# EAGLE design RadioPixelHardware (EAGLE 7.1.0)
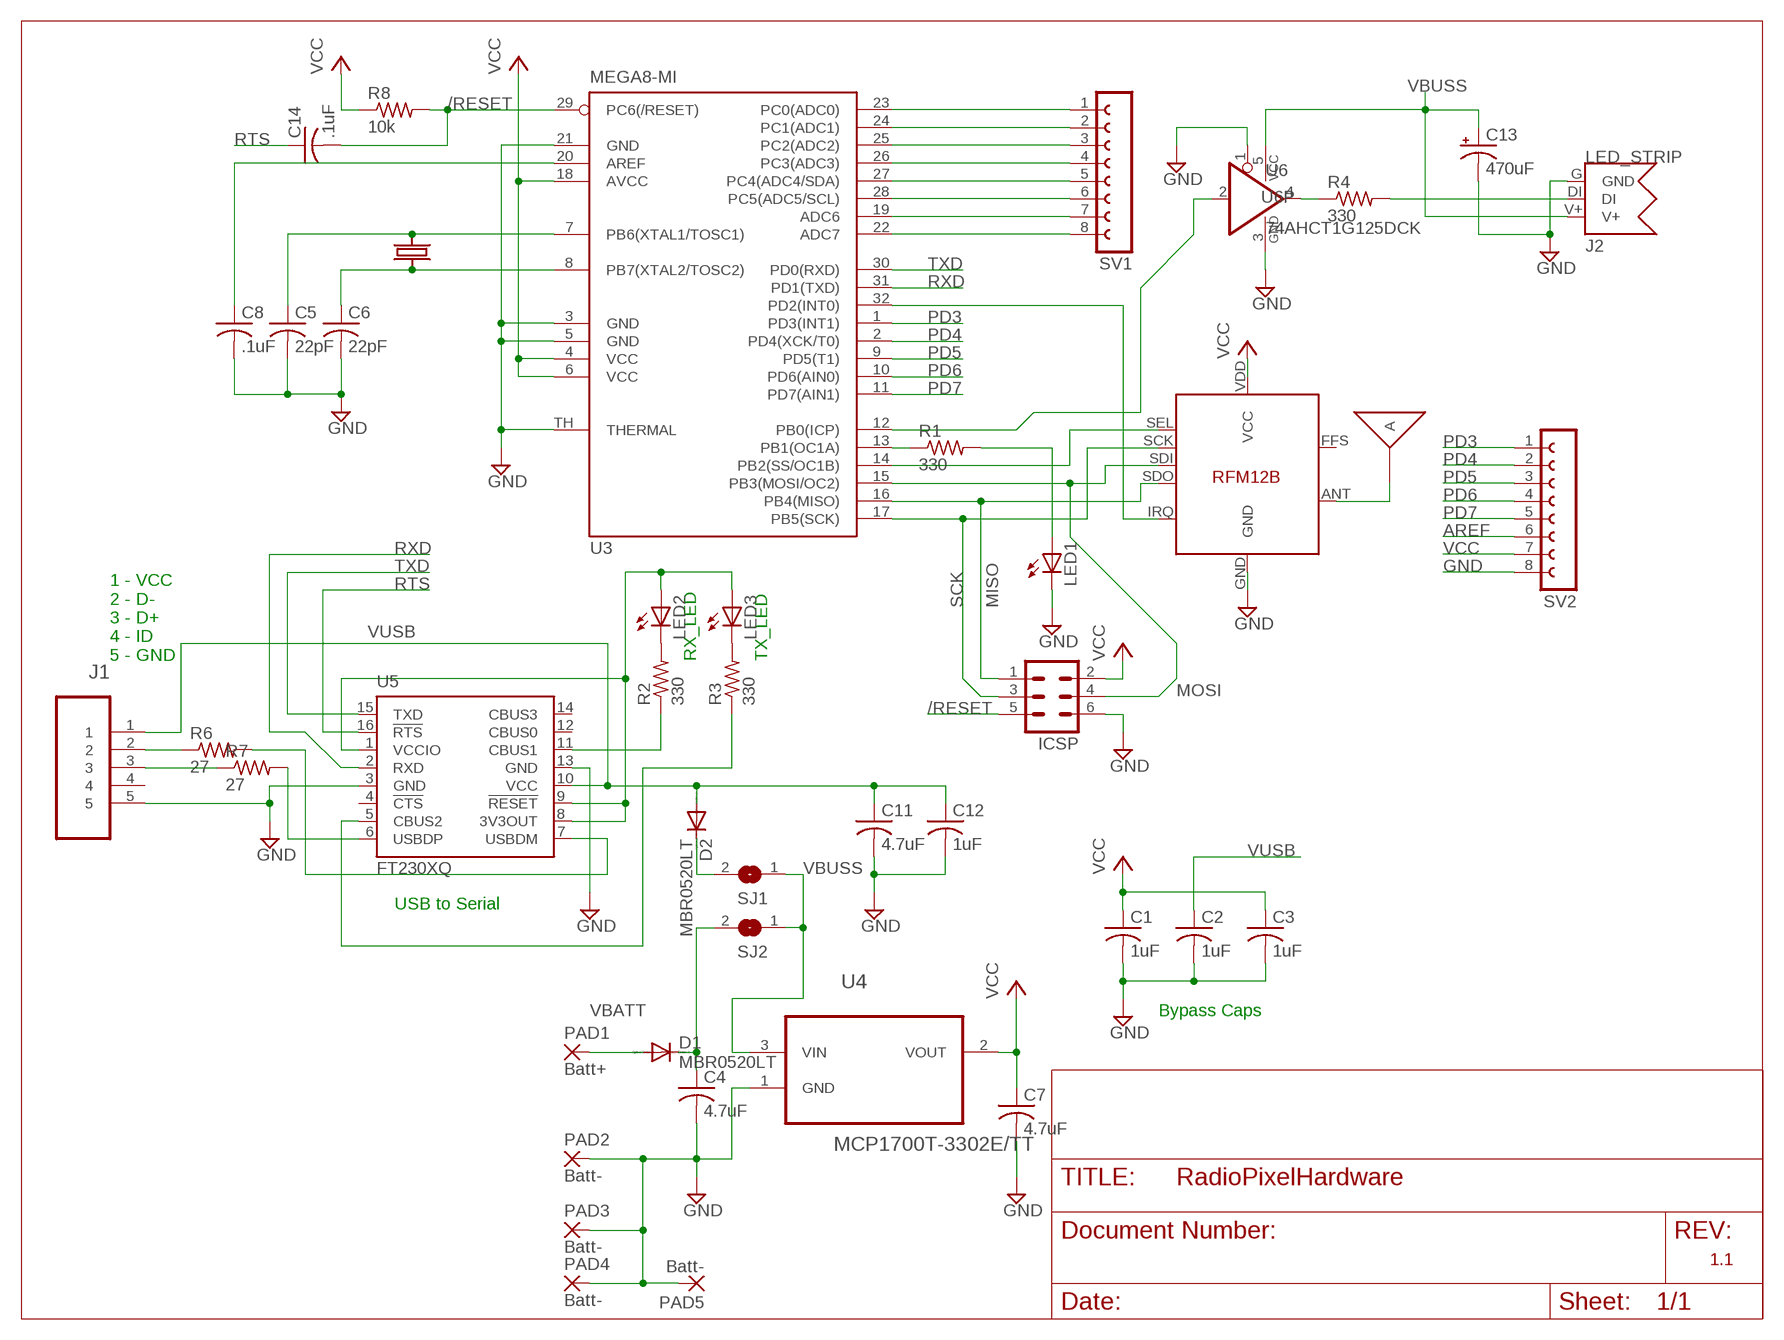
[diagram p0: schematic, sheet 1]

## Parts
C1  1uF  C-USC0603  [C0603]
C2  1uF  C-USC0603  [C0603]
C3  1uF  C-USC0603  [C0603]
C4  4.7uF  C-USC0603  [C0603]
C5  22pF  C-USC0603  [C0603]
C6  22pF  C-USC0603  [C0603]
C7  4.7uF  C-USC0603  [C0603]
C8  .1uF  C-USC0603  [C0603]
C11  4.7uF  C-USC0603  [C0603]
C12  1uF  C-USC0603  [C0603]
C13  470uF  CPOL-USTT2D4L  [TT2D4L]
C14  .1uF  C-USC0603  [C0603]
D1  MBR0520LT  [SOD123]
D2  MBR0520LT  [SOD123]
ICSP  MA03-2  [MA03-2]
J1  47346-0001  [MOLEX_47346-0001]
J2  LED_STRIP  [LEDSTRIP_HEAD]
LED1  LEDSML0603  [SML0603]
LED2  LEDSML0603  [SML0603]
LED3  LEDSML0603  [SML0603]
PAD1  Batt+  1,6/0,8  [1,6/0,8]
PAD2  Batt-  1,6/0,8  [1,6/0,8]
PAD3  Batt-  1,6/0,8  [1,6/0,8]
PAD4  Batt-  1,6/0,8  [1,6/0,8]
PAD5  Batt-  1,6/0,8  [1,6/0,8]
R1  330  R-US_R0603  [R0603]
R2  330  R-US_R0603  [R0603]
R3  330  R-US_R0603  [R0603]
R4  330  R-US_R0603  [R0603]
R6  27  R-US_R0603  [R0603]
R7  27  R-US_R0603  [R0603]
R8  10k  R-US_R0603  [R0603]
SJ1  SJ  [SJ]
SJ2  SJ  [SJ]
SV1  FE08-1  [FE08]
SV2  FE08-1  [FE08]
U2  RFM12B  [RFM12B]
U3  MEGA8-MI  [MLF32-TH]
U4  MCP1700T-3302E/TT  [SOT95P237X112-3N]
U5  FT230XQ  [QFN16]
U6  74AHCT1G125DCK  [SC70-5]
U$2  ANTANT-PCB-868MHZ  [ANT-900MHZ-60DBM]
X1  CRYSTAL3.2MMX2.5MM  [XTAL-SMD-3.2X2.5]

## Nets
/RESET: C14.2 ICSP.5 R8.2 U3.29(PC6(/RESET))
AREF: C8.1 SV2.6 U3.20(AREF)
GND: C1.2 C2.2 C3.2 C4.2 C5.2 C6.2 C7.2 C8.2 C11.2 C12.2 C13.- ICSP.6 J1.5 J2.G(GND) LED1.C PAD2.1(P) PAD3.1(P) PAD4.1(P) PAD5.1(P) SV2.8 U2.GND U3.3(GND) U3.5(GND) U3.21(GND) U3.TH(THERMAL) U4.1(GND) U5.3(GND) U5.13(GND) U6.1(OE) U6.3(GND)
MISO: ICSP.1 U2.SDO U3.16(PB4(MISO))
MOSI: ICSP.4 U2.SDI U3.15(PB3(MOSI/OC2))
N$4: U2.SEL U3.14(PB2(SS/OC1B))
N$5: U2.IRQ U3.32(PD2(INT0))
N$6: U2.ANT U$2.P$1(A)
N$7: R1.1 U3.13(PB1(OC1A))
N$8: LED1.A R1.2
N$9: R4.1 U6.4(O)
N$11: R2.1 U5.11(CBUS1)
N$12: U3.12(PB0(ICP)) U6.2(I)
N$13: R7.2 U5.6(USBDP)
N$14: R6.2 U5.7(USBDM)
N$15: C4.1 D1.C SJ2.2
N$16: LED2.C R2.2
N$17: LED3.C R3.2
N$18: J1.2 R6.1
N$19: R3.1 U5.5(CBUS2)
N$20: C5.1 U3.7(PB6(XTAL1/TOSC1)) X1.3
N$21: D2.C SJ1.2
N$22: C6.1 U3.8(PB7(XTAL2/TOSC2)) X1.1
N$23: J1.3 R7.1
N$24: SV1.1 U3.23(PC0(ADC0))
N$25: SV1.2 U3.24(PC1(ADC1))
N$26: SV1.3 U3.25(PC2(ADC2))
N$27: SV1.4 U3.26(PC3(ADC3))
N$28: SV1.5 U3.27(PC4(ADC4/SDA))
N$29: SV1.6 U3.28(PC5(ADC5/SCL))
N$30: SV1.7 U3.19(ADC6)
N$31: SV1.8 U3.22(ADC7)
N$32: J2.DI R4.2
PD3: SV2.1 U3.1(PD3(INT1))
PD4: SV2.2 U3.2(PD4(XCK/T0))
PD5: SV2.3 U3.9(PD5(T1))
PD6: SV2.4 U3.10(PD6(AIN0))
PD7: SV2.5 U3.11(PD7(AIN1))
RTS: C14.1 U5.16(!RTS)
RXD: U3.31(PD1(TXD)) U5.2(RXD)
SCK: ICSP.3 U2.SCK U3.17(PB5(SCK))
TXD: U3.30(PD0(RXD)) U5.15(TXD)
USB3V3: LED2.A LED3.A U5.1(VCCIO) U5.8(3V3OUT) U5.9(!RESET)
VBATT: D1.A PAD1.1(P)
VBUSS: C13.+ J2.V+ SJ1.1 SJ2.1 U4.3(VIN) U6.5(VCC)
VCC: C1.1 C3.1 C7.1 ICSP.2 R8.1 SV2.7 U2.VDD(VCC) U3.4(VCC) U3.6(VCC) U3.18(AVCC) U4.2(VOUT)
VUSB: C2.1 C11.1 C12.1 D2.A J1.1 U5.10(VCC)
Unconnected: J1.4 U2.FFS U5.4(!CTS) U5.12(CBUS0) U5.14(CBUS3)

## Notes on the sheet
- 1 - VCC
  2 - D-
  3 - D+
  4 - ID
  5 - GND
- RX_LED | TX_LED
- USB to Serial
- Bypass Caps
- 1.1

## Library data of the parts
C1-C8 C11 C12 C14 = resistor:C-US: CAPACITOR, American symbol
C13 = rcl:CPOL-US: POLARIZED CAPACITOR, American symbol; OC_NEWARK: 39T9032
D1 D2 = diode:MBR0520LT: SCHOTTKY BARRIER RECTIFIER Source: http://onsemi.com .. MBR0520LT1-D.pdf
ICSP = con-lstb:MA03-2: PIN HEADER; OC_FARNELL: unknown; OC_NEWARK: unknown
J1 = Molex-47346-0001:47346-0001: CONN RCPT 5POS MICRO USB R/A SMD; MPN: 47346-0001; OC_FARNELL: 1568026; OC_NEWARK: 47M0505; PACKAGE: 5 POS MICRO USB R/A; SUPPLIER: MOLEX
J2 = Dan Afonso:LED_STRIP
LED1-LED3 = led:LED: LED OSRAM: - CHIPLED LG R971, LG N971, LY N971, LG Q971, LY Q971, LO R971, LY R971 LH N974, LH R974 LS Q976, LO Q976, LY Q976 LO Q996 - Hyper CHIPLED LW Q18S LB Q993, LB Q99A, LB R99A - SideLED LS A670, LO A670, LY A670, LG A670, LP A670 LB A673, LV A673, LT A673, LW A673 LH A674 LY A675 LS A676, LA A676, LO A676, LY A676, LW A676 LS A679, LY A679, LG A679 - Hyper Micro SIDELED® LS Y876, LA Y876, LO Y876, LY Y876 LT Y87S - SmartLED LW L88C, LW L88S LB L89C, LB L89S, LG L890 LS L89K, LO L89K, LY L89K LS L896, LA L896, LO L896, LY L896 - TOPLED LS T670, LO T670, LY T670, LG T670, LP T670 LSG T670, LSP T670, LSY T670, LOP T670, LYG T670 LG T671, LOG T671, LSG T671 LB T673, LV T673, LT T673, LW T673 LH T674 LS T676, LA T676, LO T676, LY T676, LB T676, LH T676, LSB T676, LW T676 LB T67C, LV T67C, LT T67C, LS T67K, LO T67K, LY T67K, LW E67C LS E67B, LA E67B, LO E67B, LY E67B, LB E67C, LV E67C, LT E67C LW T67C LS T679, LY T679, LG T679 LS T770, LO T770, LY T770, LG T770, LP T770 LB T773, LV T773, LT T773, LW T773 LH T774 LS E675, LA E675, LY E675, LS T675 LS T776, LA T776, LO T776, LY T776, LB T776 LHGB T686 LT T68C, LB T68C - Hyper Mini TOPLED® LB M676 - Mini TOPLED Santana® LG M470 LS M47K, LO M47K, LY M47K Source: http://www.osram.convergy.de LUXEON: - LUMILED® LXK2-PW12-R00, LXK2-PW12-S00, LXK2-PW14-U00, LXK2-PW14-V00 LXK2-PM12-R00, LXK2-PM12-S00, LXK2-PM14-U00 LXK2-PE12-Q00, LXK2-PE12-R00, LXK2-PE12-S00, LXK2-PE14-T00, LXK2-PE14-U00 LXK2-PB12-K00, LXK2-PB12-L00, LXK2-PB12-M00, LXK2-PB14-N00, LXK2-PB14-P00, LXK2-PB14-Q00 LXK2-PR12-L00, LXK2-PR12-M00, LXK2-PR14-Q00, LXK2-PR14-R00 LXK2-PD12-Q00, LXK2-PD12-R00, LXK2-PD12-S00 LXK2-PH12-R00, LXK2-PH12-S00 LXK2-PL12-P00, LXK2-PL12-Q00, LXK2-PL12-R00 Source: www.luxeon.com KINGBRIGHT: KA-3528ASYC Source: www.kingbright.com
PAD1-PAD5 = wirepad:1,6/0,8: THROUGH-HOLE PAD
R1-R4 R6-R8 = resistor:R-US_: RESISTOR, American symbol
SJ1 SJ2 = jumper:SJ: SMD solder JUMPER
SV1 SV2 = con-lsta:FE08-1: FEMALE HEADER; OC_FARNELL: unknown; OC_NEWARK: unknown
U2 = JeeParts:RFM12B
U3 = atmel:MEGA8-MI: MICROCONTROLLER 8 Kbytes FLASH, 1 kbytes SRAM, 512 bytes EEPROM, USART, 6-channel 10 bit ADC, 2-channel 8 bit ADC Pin compatible with Atmega48, ATMega88, ATMega168 Source: avr.lbr; MPN: ATMEGA88PA-MU; OC_FARNELL: 1715491; OC_NEWARK: 15R0272
U4 = Dan Afonso:MCP1700T-3302E/TT: Low Quiescent Current LDO; MPN: MCP1700T-3302E/TT; OC_FARNELL: 1296592; OC_NEWARK: 88H9817; PACKAGE: SOT23-3; SUPPLIER: Microchip
U5 = ftdichip:FT230X: USB to BASIC UART IC Auto generated by make-symbol-device-package-bsdl.ulp Rev. 43 Source: Data sheet <http://www.ftdichip.com/Support/Documents/DataSheets/ICs/DS_FT230X.pdf>
U6 = 74xx-little-de:74*1G125: Single Bus Buffer Gate with 3-State Output; OC_NEWARK: 76C1732
U$2 = Dan Afonso:ANT: PCB Antenna - 868-920MHz This large PCB antenna is modeled after Texas Instruments DN024 <http://www.ti.com/general/docs/lit/getliterature.tsp?baseLiteratureNumber=swra227> application note. Key features Single Band Mode (868 MHz, 915 MHz or 920 MHz) Dual Band Mode (868 MHz & 2440 MHz) PCB Antenna Monopole Antenna Excellent Efficiency Recommended Antenna Design for 868 MHz, 915 MHz & 920 MHz
X1 = Dan Afonso:CRYSTAL: TXC Crystal 3.2mm x 2.5mm; OC_NEWARK: 24T5694

## Board
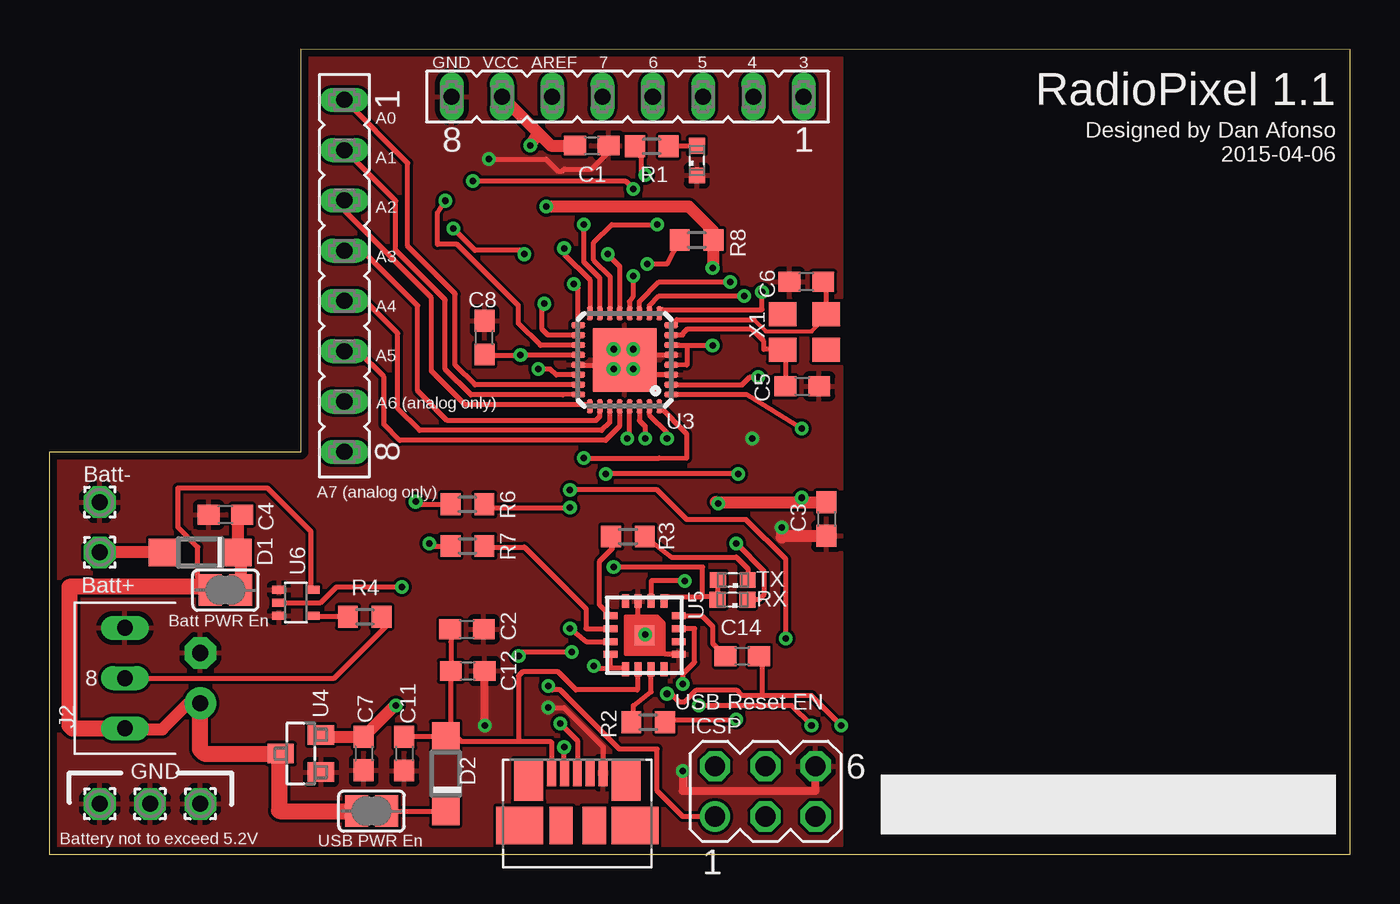
[diagram p1: board, top side]
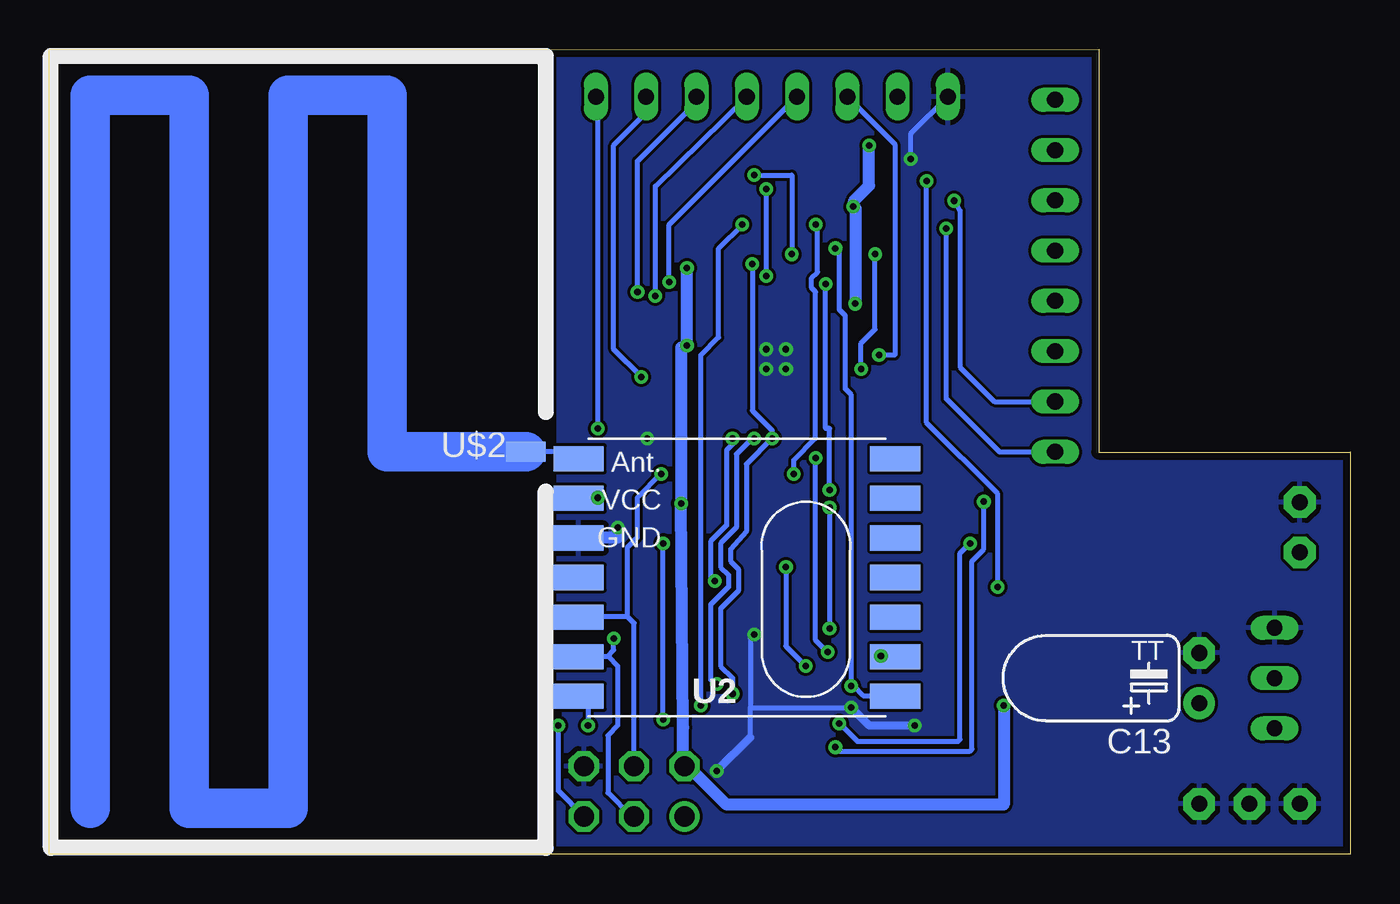
[diagram p2: board, bottom side, seen from below]

Size 65.71 x 40.64 mm. Coordinates in mm from the lower left corner, seen from the top.
Outline: 0,20.31 12.7,20.31 12.7,40.64 65.71,40.63 65.71,0 0,0 0,20.31
Outline: 0,20.32 0,20.31
Copper layers (1*16): Top 0.0356mm / dielectric 1.5011mm / Bottom 0.0356mm
Design rules "OSHPark": minimum track width 6mil, minimum drill 13mil, track to track 6mil, track to pad 6mil, pad to pad 6mil, via to via 6mil, smd to smd 6mil, copper to edge 15mil, drill to drill 6mil, minimum pad ring 7mil, minimum via ring 7mil, stop-mask expansion 3mil, vias tented up to drill 0mil, thermal gap 10mil

### Footprints (pad centres in the part's own frame; a part is rotated, then mirrored left to right if it is on the bottom)
C0603 = smd 1.1 x 1: 1 -0.85,0; 2 0.85,0
TT2D4L = drill 0.813 pad 1.6: + -1.27,0 | drill 0.813 pad 1.6 octagon: - 1.27,0
SOD123 = smd 1.4 x 1.4: A 1.9,0; C -1.9,0
MA03-2 = drill 1.016: 1 -2.54,-1.27 | drill 1.016 octagon: 2 -2.54,1.27; 3 0,-1.27; 4 0,1.27; 5 2.54,-1.27; 6 2.54,1.27
MOLEX_47346-0001 = smd 0.45 x 1.38: 1 -1.3,0; 2 -0.65,0; 3 0,0; 4 0.65,0; 5 1.3,0 | smd 1.475 x 2.1: M1 -2.462,-0.36; M2 2.462,-0.36 | smd 2.375 x 1.9: M3 -2.913,-2.66; M6 2.913,-2.66 | smd 1.175 x 1.9: M4 -0.82,-2.66; M5 0.85,-2.66
LEDSTRIP_HEAD = drill 0.8 long: DI 0,0; G 0,2.54; V+ 0,-2.54
SML0603 = smd 0.8 x 0.8: A 0.75,0; C -0.75,0
1,6/0,8 = drill 0.813 pad 1.6 octagon: 1 0,0
R0603 = smd 1 x 1.1: 1 -0.85,0; 2 0.85,0
SJ = smd 1.168 x 1.6: 1 -0.762,0; 2 0.762,0
FE08 = drill 0.813 long: 1 -8.89,0; 2 -6.35,0; 3 -3.81,0; 4 -1.27,0; 5 1.27,0; 6 3.81,0; 7 6.35,0; 8 8.89,0
RFM12B = smd 2.54 x 1.27: ANT 8,-6; FFS -8,2; GND 8,-2; IRQ -8,4; P$8 -8,0; P$9 -8,-2; P$10 -8,-4; P$12 -8,-6; P$16 8,0; SCK 8,4; SDI 8,2; SDO -8,6; SEL 8,6; VDD 8,-4
MLF32-TH = smd 0.7 x 0.3: 1 -2.35,1.75; 2 -2.35,1.25; 3 -2.35,0.75; 4 -2.35,0.25; 5 -2.35,-0.25; 6 -2.35,-0.75; 7 -2.35,-1.25; 8 -2.35,-1.75; 17 2.35,-1.75; 18 2.35,-1.25; 19 2.35,-0.75; 20 2.35,-0.25; 21 2.35,0.25; 22 2.35,0.75; 23 2.35,1.25; 24 2.35,1.75 | smd 0.3 x 0.7: 9 -1.75,-2.35; 10 -1.25,-2.35; 11 -0.75,-2.35; 12 -0.25,-2.35; 13 0.25,-2.35; 14 0.75,-2.35; 15 1.25,-2.35; 16 1.75,-2.35; 25 1.75,2.35; 26 1.25,2.35; 27 0.75,2.35; 28 0.25,2.35; 29 -0.25,2.35; 30 -0.75,2.35; 31 -1.25,2.35; 32 -1.75,2.35 | smd 3.2 x 3.2: TH 0,0
SOT95P237X112-3N = smd 0.991 x 1.321: 1 -0.94,-1.016; 2 0.94,-1.016; 3 0,1.016
QFN16 = smd 0.7 x 0.35: 1 -1.725,0.975; 2 -1.725,0.325; 3 -1.725,-0.325; 4 -1.725,-0.975; 9 1.725,-0.975; 10 1.725,-0.325; 11 1.725,0.325; 12 1.725,0.975 | smd 0.35 x 0.7: 5 -0.975,-1.725; 6 -0.325,-1.725; 7 0.325,-1.725; 8 0.975,-1.725; 13 0.975,1.725; 14 0.325,1.725; 15 -0.325,1.725; 16 -0.975,1.725 | smd 1 x 1: TAB 0,0
SC70-5 = smd 0.4 x 0.7: 1 -0.65,-0.85; 2 0,-0.85; 3 0.65,-0.85; 4 0.65,0.85; 5 -0.65,0.85
ANT-900MHZ-60DBM = smd 1 x 2: P$1 0,1
XTAL-SMD-3.2X2.5 = smd 1.4 x 1.2: 1 -1.1,-0.9; 2 1.1,-0.9; 3 1.1,0.9; 4 -1.1,0.9

### Placement (x,y rotation side)
C1  27.4,35.79 0 top
C2  21.09,11.36 0 top
C3  39.25,16.93 270 top
C4  8.89,17.14 180 top
C5  38.04,23.63 0 top
C6  38.24,28.91 180 top
C7  15.88,5.08 270 top
C8  21.98,26.09 90 top
C11  17.93,5.07 270 top
C12  21.13,9.25 0 top
C13  7.62,8.89 90 bottom
C14  35,10 0 top
D1  7.62,15.24 180 top
D2  20.02,4.07 90 top
ICSP  36.17,3.17 0 top
J1  26.67,4.11 0 top
J2  3.81,8.89 0 top
LED1  32.71,35.03 90 top
LED2  34.51,12.86 180 top
LED3  34.53,13.85 180 top
PAD1  2.54,15.24 0 top
PAD2  2.54,17.78 0 top
PAD3  2.54,2.54 0 top
PAD4  5.08,2.54 0 top
PAD5  7.62,2.54 0 top
R1  30.43,35.75 0 top
R2  30.25,6.66 0 top
R3  29.23,16.04 0 top
R4  15.93,11.99 0 top
R6  21.12,17.66 0 top
R7  21.12,15.56 0 top
R8  32.7,31.02 180 top
SJ1  16.27,2.17 0 top
SJ2  8.89,13.34 0 top
SV1  14.9,29.21 270 top
SV2  29.21,38.26 180 top
U2  30.98,13.97 180 bottom
U3  29.06,24.96 180 top
U4  12.7,5.08 90 top
U5  30.07,11.06 270 top
U6  12.45,12.7 270 top
U$2  40.64,20.32 90 bottom
X1  38.14,26.37 180 top

### Tracks (layer width: path | path; a pad name or v marks a point on that pad's centre or on a via)
/RESET  (via drill 0.33)
  Top 0.254: v40,6.5 38.5,8 36,8 | 36,8 35,8 34.7,8.3 32.7,8.3 32.1,7.7 31.8,7.7 31.4,8.1 v31.2,8.1 31.1,8.1 | R8.2 31.82,31 31.2,29.8 v30.2,29.8 | v29.2,21 29.31,21.11 U3.29 | C14.2 36,10 36,8
  Bottom 0.254: ICSP.5 40,3.19 v40,6.5 | v30.2,29.8 30.2,22.4 29.2,21.4 v29.2,21 30.5,19.7 30.5,16.3 31.3,15.4 31.3,14.8 30.9,14.4 30.9,13.3 31.8,12.4 31.8,9.5 31.2,8.9 v31.2,8.1
AREF  (via drill 0.33)
  Top 0.254: U3.20 23.71,25.21 v23.8,25.2 22.02,25.2 C8.1
  Bottom 0.254: SV2.6 23,35.86 23,25.2 v23.8,25.2
GND  (via drill 0.33)
  Top 0.254: v22.2,35.1 25.1,35.1 25.7,34.5 25.9,34.5 26,34.6 27.4,34.6 28.25,35.45 C1.2 | U3.5 31.39,25.2 30,25.2 29.77,24.96 U3.TH 28.07,24.96 27.8,24.7 26.73,24.7 U3.21 | U5.13 31.78,10.1 31.1,10.1 v30.1,11.1 29.75,11.46 U5.3 | v25.2,7.4 26,7.4 27.97,5.43 J1.5 | U3.3 29.79,24.21 v29.5,24.5
  Top 0.406: v22,6.5 21.98,6.52 C12.2 | v32,4.2 32,3.2 38.7,3.2 38.71,4.21 ICSP.6
  Top 0.61: v37,16.5 37,16 37.08,16.07 C3.2
  Bottom 0.254: SV2.8 22.2,36.38 v22.2,35.1 | v30.1,11.1 30.3,10.9 30.3,7.4 | 30.3,5.9 30.3,7.4 | 30.3,7.4 v25.2,7.4
  Bottom 0.406: v25.2,7.4 24.3,6.5 v22,6.5 | 30.3,5.9 v32,4.2
  Bottom 0.61: U2.GND 38.95,16 37,16 v37,16.5
  other vias: 35.5,21 28.5,25.5 28.5,24.5 29.5,25.5
  pour Top: 0,0 40,0 40,40.5 12.7,40.5 12.7,20.3 0,20.3
  pour Bottom: 0,0 0,20.2 0,20.3 12.7,20.3 12.7,40.5 40,40.5 40,0
MISO  (via drill 0.33)
  Top 0.254: ICSP.1 32,1.9 30.7,3.2 30.7,5.3 28.8,5.3 25.8,8.3 25.4,8.3 v25.2,8.5 | v26,30.6 26,30.3 27.3,29 U3.16
  Bottom 0.254: U2.SDO 23.01,8 24.6,8 25.1,8.5 v25.2,8.5 25.2,23.2 25.5,23.5 25.5,27.2 25.8,27.5 25.8,30.4 v26,30.6
MOSI  (via drill 0.33)
  Top 0.254: U3.15 27.81,29.09 27,29.9 v27,31.8 | v34.8,19.2 v28.1,19.2
  Bottom 0.254: ICSP.4 36.17,11.67 36.5,12 | 36.5,12 38.95,12 U2.SDI | 36.5,12 36.5,15.5 36,16 36,18 v34.8,19.2 | v28.1,19.2 28.1,19.9 27,21 27,28.4 27.2,28.6 27.2,29.1 26.9,29.4 26.9,31.8 v27,31.8
N$4  (via drill 0.33)
  Top 0.254: v38.5,6.5 37.5,7.5 v32.8,7.5 | U3.14 28.31,29.19 27.5,30 27.5,30.9 28.4,31.8 v30.7,31.8
  Bottom 0.254: U2.SEL 38.5,7.49 v38.5,6.5 | v32.8,7.5 32.8,25.2 31.9,26.1 31.9,30.6 v30.7,31.8
N$5  (via drill 0.33)
  Top 0.254: v27,20 30.8,20 30.81,20.01 32.2,20 32.2,21.21 U3.32 | v26.4,10.2 23.9,10.2 v23.7,10
  Bottom 0.254: v27,20 27,10.8 v26.4,10.2 | v23.7,10 23.01,10 U2.IRQ
N$6
  Bottom 0.254: U2.ANT 39.33,20.32 U$2.P$1
  Bottom 1.27: 41.64,19.97 U$2.P$1
N$7  (via drill 0.33)
  Top 0.254: R1.1 29.5,35.67 29.9,35.2 29.9,34.5 v30.1,34.3 | v28.2,30.3 28.81,29.69 U3.13
  Bottom 0.254: v30.1,34.3 28.2,34.3 v28.2,30.3
N$8
  Top 0.254: R1.2 31.31,35.78 LED1.A
N$9
  Top 0.254: R4.1 13.36,11.99 U6.4
N$11
  Top 0.254: R2.1 29.5,6.76 29.5,7.5 30.39,8.2 U5.11
N$12  (via drill 0.33)
  Top 0.254: U6.2 13.7,12.7 14.5,13.5 v17.8,13.5 | U3.12 29.3,27.9 29.5,28.2 v29.5,29.2 | v21.4,34 29.1,34 v29.5,33.6
  Bottom 0.254: v17.8,13.5 17.8,18.2 21.4,21.8 v21.4,34 | v29.5,33.6 v29.5,29.2
N$13
  Top 0.254: R7.2 22.03,15.5 24,15.5 27.1,12.4 27.1,11.4 27.11,11.38 U5.6
N$14  (via drill 0.33)
  Top 0.254: R6.2 22,17.5 v26.3,17.5 | v26.3,11.4 27.14,10.73 U5.7
  Bottom 0.254: v26.3,17.5 v26.3,11.4
N$15
  Top 0.254: C4.1 9.52,16.93 | D1.C 9.65,15.11
  Top 0.61: 9.52,16.93 D1.C | 9.65,15.11 SJ2.2
N$16  (via drill 0.33)
  Top 0.254: R2.2 31.23,6.8 v34.7,6.8 | v34.7,15.7 36.1,14.3 36.1,13.1 35.85,12.86 LED2.C
  Bottom 0.254: v34.7,6.8 v34.7,15.7
N$17
  Top 0.254: R3.2 31.42,15 34.7,15 35.28,14.42 LED3.C
N$18  (via drill 0.33)
  Top 0.254: J1.2 26,4.13 v26,5.4 | v18.5,17.8 18.64,17.66 R6.1
  Bottom 0.254: v26,5.4 25.8,5.2 19.2,5.2 19.1,5.3 19.1,14.8 18.5,15.4 v18.5,17.8
N$19
  Top 0.254: U5.5 27.8,12.58 27.8,14.8 28.44,15.44 R3.1
N$20
  Top 0.254: U3.7 31.98,26.21 32,26.3 32.2,26.5 35.5,26.5 36.1,25.9 36.1,25.5 37.01,25.5 X1.3 37.19,25.32 C5.1
N$21
  Top 0.254: SJ1.2 17.04,2.17 D2.C
N$22
  Top 0.203: 35.6,27 36.2,26.4 38.5,26.4 39.24,27.14
  Top 0.254: U3.8 31.7,27 35.6,27 | 39.24,27.14 X1.1 39.24,28.76 C6.1
N$23  (via drill 0.33)
  Top 0.254: J1.3 26.7,4.18 26.7,5.7 v25.8,6.6 | v19.2,15.7 19.34,15.56 R7.1
  Bottom 0.254: v25.8,6.6 24.9,5.7 19.8,5.7 19.7,5.8 19.7,15.2 v19.2,15.7
N$24
  Top 0.254: U3.23 26.7,23.7 21.5,23.7 20.5,24.7 20.5,28.3 18.1,30.7 18.1,34.9 SV1.1
N$25
  Top 0.254: U3.24 25.93,23.2 21.3,23.2 20,24.5 20,28 17.5,30.5 17.5,33 14.94,35.56 SV1.2
N$26
  Top 0.254: U3.25 27.2,22.7 21,22.7 19.3,24.4 19.3,28.1 14.9,32.5 SV1.3
N$27
  Top 0.254: U3.26 27.8,22.1 27.6,21.9 20.1,21.9 18.6,23.4 18.6,27.7 15.82,30.48 SV1.4
N$28
  Top 0.254: U3.27 28.3,21.8 27.9,21.4 18.7,21.4 17.6,22.5 17.6,26.3 15.96,27.94 SV1.5
N$29
  Top 0.254: U3.28 28.8,21.6 28.1,20.9 17.7,20.9 16.9,21.7 16.9,24.1 15.6,25.4 SV1.6
N$30  (via drill 0.33)
  Top 0.254: U3.19 26.7,25.7 24.8,25.7 23.7,26.8 23.7,27.7 20.6,30.8 19.6,30.8 19.6,32.4 v20,33
  Bottom 0.254: v20,33 19.7,32.5 19.7,24.6 17.96,22.86 SV1.7
N$31  (via drill 0.33)
  Top 0.254: U3.22 26.7,24.2 25.6,24.2 25.3,24.5 v24.7,24.5 | v24,30.3 23.8,30.5 21.5,30.5 v20.4,31.6
  Bottom 0.254: v24.7,24.5 24.7,25.8 24,26.5 v24,30.3 | SV1.8 14.92,20.3 17.7,20.3 20.4,23 v20.4,31.6
N$32
  Top 0.254: J2.DI 14.39,8.89 17,11.5 17,11.76 R4.2
PD3  (via drill 0.33)
  Top 0.254: U3.1 35.22,23.21 v38,21.5
  Bottom 0.254: v38,21.5 38,38.16 SV2.1
PD4  (via drill 0.33)
  Top 0.254: U3.2 31.43,23.7 35,23.7 35.4,24.1 v35.8,24.1
  Bottom 0.254: v35.8,24.1 37.2,25.5 37.2,35.8 35.56,37.44 SV2.2
PD5  (via drill 0.33)
  Top 0.254: U3.9 31,27.5 36,27.5 v36,28.4
  Bottom 0.254: v36,28.4 36,35 33.02,37.98 SV2.3
PD6  (via drill 0.33)
  Top 0.254: U3.10 30.31,27.71 30.8,28.2 v35.1,28.2
  Bottom 0.254: v35.1,28.2 35.1,33.74 SV2.4
PD7  (via drill 0.33)
  Top 0.254: U3.11 29.81,27.91 30.8,28.9 v34.4,28.9
  Bottom 0.254: v34.4,28.9 34.4,31.8 SV2.5
RTS
  Top 0.254: U5.16 32.97,12.04 33.5,11.5 33.5,10.65 C14.1
RXD  (via drill 0.33)
  Top 0.254: U3.31 30.3,22.2 31.2,21.3 v31.2,21 | v32.1,13.8 30.4,13.8 30.39,13.79 U5.2
  Bottom 0.254: v31.2,21 31.2,20.7 31.5,20.4 31.5,16.6 32.3,15.8 32.3,13.8 v32.1,13.8
SCK  (via drill 0.33)
  Top 0.254: v37.2,10.9 37.2,14.9 35.2,16.9 32.2,16.9 30.7,18.4 v26.3,18.4 | U3.17 26.71,28.59 v26.5,28.8
  Bottom 0.254: U2.SCK 38.95,10 37.5,10 | 37.5,10 37,9.5 37,6.5 37.5,6 37.5,3.1 36.3,1.9 ICSP.3 | 37.5,10 37.2,10.3 v37.2,10.9 | v26.3,18.4 26.3,21.5 26.5,21.5 v26.5,28.8
TXD  (via drill 0.33)
  Top 0.254: U3.30 29.8,21.9 30.1,21.6 v30.1,21 | v32,8.6 32,9.1 32.6,9.7 32.6,11.4 32.59,11.38 U5.15
  Bottom 0.254: 32,8.8 v32,8.6 32.3,8.8 32.3,12.6 31.4,13.5 31.4,14.1 31.8,14.5 31.8,15.7 31,16.5 31,20.2 30.2,21 v30.1,21
USB3V3  (via drill 0.33)
  Top 0.254: LED3.A 33.76,13.82 LED2.A 33.65,12.86 33.5,13 33,13 | U5.9 29.03,9.4 28.3,9.4 | 28.3,9.4 28.34,9.45 U5.8 | U5.1 31.26,13 33,13 | 33,13 33,14.5 v28.5,14.5 | v27.5,9.5 27.6,9.4 28.3,9.4
  Bottom 0.254: v28.5,14.5 28.5,10.5 v27.5,9.5
VBATT
  Top 0.61: D1.A PAD1.1
VBUSS
  Top 0.254: SJ2.1 7.5,13.96 7.5,15.5 6.5,16.5 6.5,18.5 11,18.5 13.2,16.3 13.2,13.45 U6.5 | J2.V+ 3.86,6.3 | 7.02,7.62 C13.+
  Top 0.61: 3.86,6.3 5.7,6.3 7.02,7.62
  Top 0.813: C13.+ 7.6,7.6 7.6,5.3 7.82,5.08 U4.3 11.6,5 11.6,2.2 11.62,2.17 SJ1.1 | SJ2.1 7.96,13.5 1,13.5 1,6.5 1.15,6.35 J2.V+
VCC  (via drill 0.33)
  Top 0.254: 32.2,25.7 31.79,25.71 U3.6 31.43,25.7 32.2,25.7 | 32.2,25.7 32.2,24.7 31.71,24.71 U3.4 | 32.2,25.7 v33.5,25.7 | v33.5,29.6 33.55,29.64 | 24.66,36.36 24.76,36.36 | v33.8,17.7 33.67,17.77 | R8.1 33.5,31.07 33.5,31.5 | U4.2 13.81,5.93 | 17.45,7.5 v17.5,7.5 | U3.18 25.18,26.21 24.9,26.5 24.9,27.7 v25,27.8 | C3.1 38.23,17.77 v38,18
  Top 0.61: 33.55,29.64 R8.1 | SV2.7 24.76,36.36 25.33,35.79 C1.1 | v24.3,35.8 24.66,36.36 | 33.67,17.77 C3.1 | 33.5,31.5 32.3,32.7 v25.1,32.7 | 13.81,5.93 C7.1 17.45,7.5
  Bottom 0.254: v33.5,25.7 33.8,25.6 | 25.1,33 v25.1,32.7 | 25.04,33.03 25,32.67 | 33.44,4.44 ICSP.2 | v38,18 38.95,18 U2.VDD
  Bottom 0.61: v33.5,25.7 v33.5,29.6 | v24.3,35.8 24.3,33.77 25.04,33.03 v25.1,32.7 | 25,32.67 v25,27.8 | 33.8,25.6 v33.8,17.7 33.7,6.4 33.7,4.67 ICSP.2 | v17.5,7.5 17.5,2.5 31.5,2.5 33.44,4.44 | U2.VDD 38.71,17.7
VUSB
  Top 0.254: C11.1 17.97,5.97 D2.A 20.28,6.23 | 20.28,6.23 C12.1 20.28,10.72 C2.1 | 20.28,6.23 20.81,5.7 23.7,5.7 | 23.7,5.7 25.3,5.7 25.37,5.63 J1.1 | U5.10 29.7,9.29 29.7,8.3 26.6,8.3 25.7,9.2 23.9,9.2 23.7,9 23.7,5.7

### Text on the board
tPlace: GND | VCC | AREF | 7 | 6 | 5 | 4 | 3 | RadioPixel 1.1 | A0 | Designed by Dan Afonso / 2015-04-06 | A1 | A2 | A3 | A4 | A5 | A6 (analog only) | Batt- | A7 (analog only) | TX | Batt+ | Batt PWR En | RX | 8 | USB Reset EN | GND | USB PWR En | Battery not to exceed 5.2V